# Altium schematic sheet Logic.SchDoc
size A
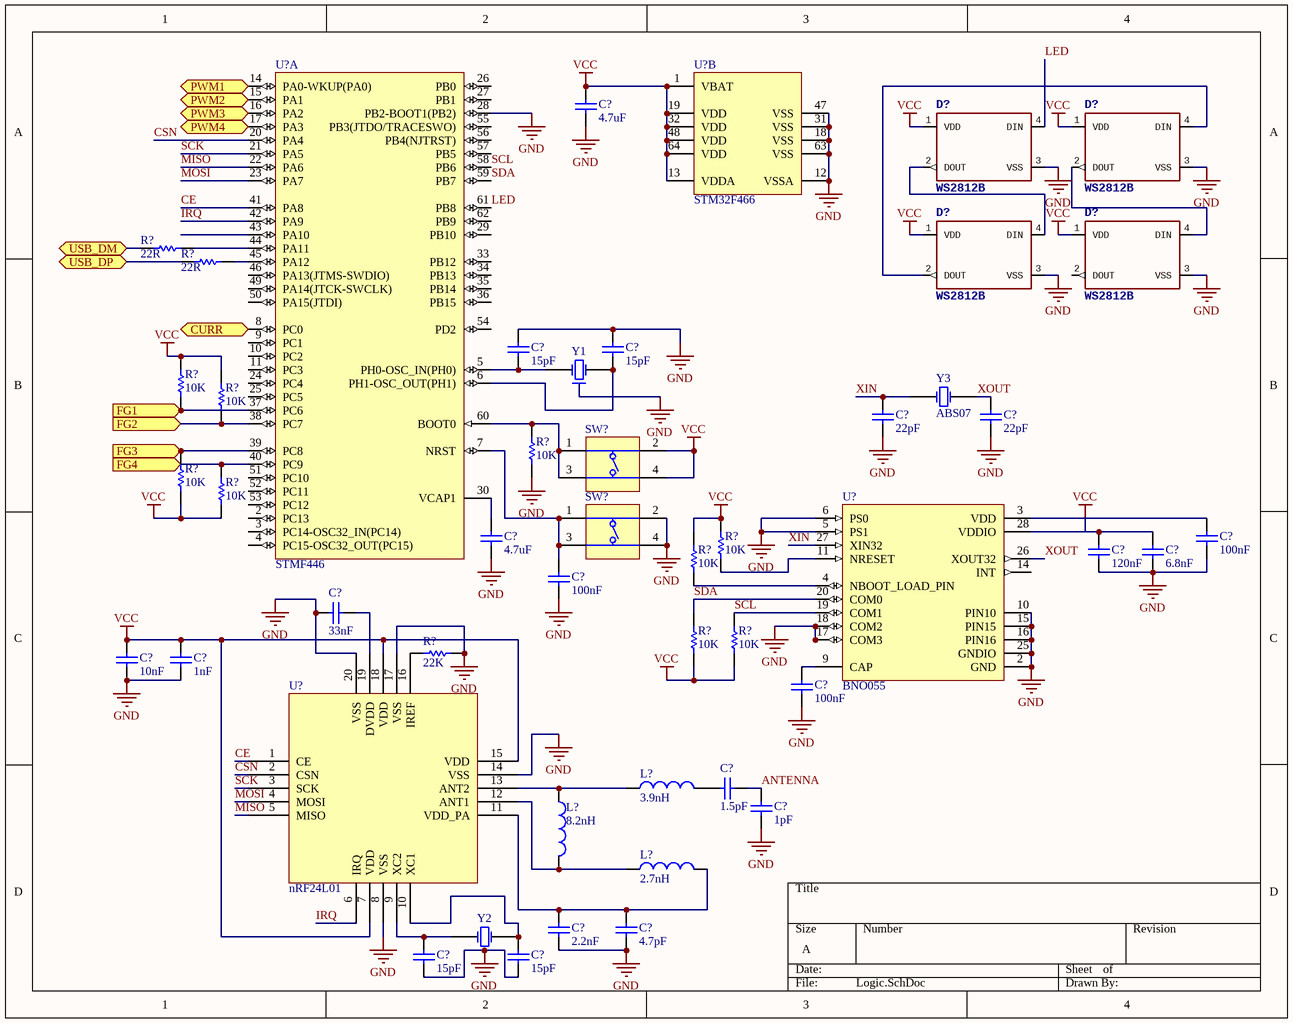
[diagram p0: Logic.SchDoc]

## Parts
(Parts that share a designator on the sheet are numbered #1, #2 ... from top to bottom, then left to right.)
C?#1  4.7uF  [CAPC0402(1005)60_L]
C?#2  15pF  [CAPC0402(1005)60_M]
C?#3  15pF  [CAPC0402(1005)60_M]
C?#4  22pF  [CAPC0402(1005)60_L]
C?#5  22pF  [CAPC0402(1005)60_L]
C?#6  4.7uF  [CAPC0402(1005)60_L]
C?#7  100nF  [CAPC0402(1005)60_M]
C?#8  120nF  [CAPC0402(1005)60_M]
C?#9  6.8nF  [CAPC0402(1005)60_L]
C?#10  100nF  [CAPC0402(1005)60_M]
C?#11  33nF  [CAPC0402(1005)60_M]
C?#12  10nF  [CAPC0402(1005)60_M]
C?#13  1nF  [CAPC0402(1005)60_M]
C?#14  100nF  [CAPC0402(1005)60_M]
C?#15  1.5pF  [CAPC0402(1005)60_L]
C?#16  1pF  [CAPC0402(1005)60_M]
C?#17  2.2nF  [CAPC0402(1005)60_N]
C?#18  4.7pF  [CAPC0402(1005)60_M]
C?#19  15pF  [CAPC0402(1005)60_N]
C?#20  15pF  [CAPC0402(1005)60_N]
D?#1  WS2812B  [WS2812B]
D?#2  WS2812B  [WS2812B]
D?#3  WS2812B  [WS2812B]
D?#4  WS2812B  [WS2812B]
L?#1  3.9nH  [INDC0402(1005)_N]
L?#2  8.2nH  [INDC0402(1005)_N]
L?#3  2.7nH  [INDC0402(1005)_N]
R?#1  22R  [RESC0402(1005)_M]
R?#2  22R  [RESC0402(1005)_M]
R?#3  10K  [RESC0402(1005)_N]
R?#4  10K  [RESC0402(1005)_N]
R?#5  10K  [RESC0402(1005)_N]
R?#6  10K  [RESC0402(1005)_N]
R?#7  10K  [RESC0402(1005)_N]
R?#8  10K  [RESC0402(1005)_N]
R?#9  10K  [RESC0402(1005)_N]
R?#10  10K  [RESC0402(1005)_N]
R?#11  10K  [RESC0402(1005)_N]
R?#12  22K  [RESC0402(1005)_L]
SW?#1  (no value)  [DIPT-DTSM-6_V]
SW?#2  (no value)  [DIPT-DTSM-6_V]
U?#1  STMF446  [STM-LQFP64_N]  (part A of 2)
U?#2  STM32F466  [STM-LQFP64_N]  (part B of 2)
U?#3  BNO055  [LGA28R50P4X10_380X520X100]
U?#4  (no value)  [QFN20]
Y1  (no value)  [ABRA-ABM3B-4_V]
Y2  (no value)  [ABRA-ABM3B-4_V]
Y3  ABS07  [ABS07]

## Ports
CURR (in), FG1 (in), FG2 (in), FG3 (in), FG4 (in), PWM1 (in), PWM2 (in), PWM3 (in), PWM4 (in), USB_DM (bidir), USB_DP (bidir)

## Nets
GND: C?#1.1 C?#2.2 C?#3.2 C?#4.1 C?#5.1 C?#6.1 C?#7.1 C?#8.1 C?#9.1 C?#10.1 C?#11.1 C?#12.1 C?#13.1 C?#14.1 C?#16.1 C?#17.1 C?#18.1 C?#19.1 C?#20.1 D?#1.3(VSS) D?#2.3(VSS) D?#3.3(VSS) D?#4.3(VSS) R?#5.1 R?#12.1 SW?#2.2(T2) SW?#2.4(T3) U?#1.28(PB2-BOOT1(PB2)) U?#2.12(VSSA) U?#2.18(VSS) U?#2.31(VSS) U?#2.47(VSS) U?#2.63(VSS) U?#3.2(GND) U?#3.5(PS1) U?#3.6(PS0) U?#3.10(PIN10) U?#3.15(PIN15) U?#3.16(PIN16) U?#3.17(COM3) U?#3.18(COM2) U?#3.25(GNDIO) U?#4.8(VSS) U?#4.14(VSS) U?#4.17(VSS) U?#4.20(VSS) Y1.2 Y2.2
VCC: C?#1.2 C?#7.2 C?#8.2 C?#9.2 C?#12.2 C?#13.2 D?#1.1(VDD) D?#2.1(VDD) D?#3.1(VDD) D?#4.1(VDD) R?#3.2 R?#4.2 R?#6.1 R?#7.1 R?#8.2 R?#9.2 R?#10.1 R?#11.1 SW?#1.2(T2) SW?#1.4(T3) U?#2.1(VBAT) U?#2.13(VDDA) U?#2.19(VDD) U?#2.32(VDD) U?#2.48(VDD) U?#2.64(VDD) U?#3.3(VDD) U?#3.28(VDDIO) U?#4.7(VDD) U?#4.15(VDD) U?#4.18(VDD)
ANTENNA: C?#15.2 C?#16.2
CE: U?#1.41(PA8) U?#4.1(CE)
CSN: U?#1.20(PA4) U?#4.2(CSN)
CURR: U?#1.8(PC0) ; port CURR
FG1: R?#3.1 U?#1.37(PC6) ; port FG1
FG2: R?#4.1 U?#1.38(PC7) ; port FG2
FG3: R?#6.2 U?#1.39(PC8) ; port FG3
FG4: R?#7.2 U?#1.40(PC9) ; port FG4
IRQ: U?#1.42(PA9) U?#4.6(IRQ)
LED: D?#1.4(DIN) U?#1.61(PB8)
MISO: U?#1.22(PA6) U?#4.5(MISO)
MOSI: U?#1.23(PA7) U?#4.4(MOSI)
PWM1: U?#1.14(PA0-WKUP(PA0)) ; port PWM1
PWM2: U?#1.15(PA1) ; port PWM2
PWM3: U?#1.16(PA2) ; port PWM3
PWM4: U?#1.17(PA3) ; port PWM4
SCK: U?#1.21(PA5) U?#4.3(SCK)
SCL: R?#11.2 U?#1.58(PB6) U?#3.19(COM1)
SDA: R?#10.2 U?#1.59(PB7) U?#3.20(COM0)
USB_DM: R?#1.1 ; port USB_DM
USB_DP: R?#2.1 ; port USB_DP
XIN: C?#4.2 U?#3.27(XIN32) Y3.1(X1)
XOUT: C?#5.2 U?#3.26(XOUT32) Y3.3(X2)
NetC?#2_1: C?#2.1 U?#1.5(PH0-OSC_IN(PH0)) Y1.1(X1)
NetC?#3_1: C?#3.1 U?#1.6(PH1-OSC_OUT(PH1)) Y1.3(X2)
NetC?#6_2: C?#6.2 U?#1.30(VCAP1)
NetC?#10_2: C?#10.2 SW?#2.1(T1) SW?#2.3(T3) U?#1.7(NRST)
NetC?#11_2: C?#11.2 U?#4.19(DVDD)
NetC?#14_2: C?#14.2 U?#3.9(CAP)
NetC?#15_1: C?#15.1 L?#1.2
NetC?#17_2: C?#17.2 C?#18.2 L?#3.2 U?#4.11(VDD_PA)
NetC?#19_2: C?#19.2 U?#4.9(XC2) Y2.1(X1)
NetC?#20_2: C?#20.2 U?#4.10(XC1) Y2.3(X2)
NetD?#1_2: D?#1.2(DOUT) D?#3.4(DIN)
NetD?#2_2: D?#2.2(DOUT) D?#4.4(DIN)
NetD?#2_4: D?#2.4(DIN) D?#3.2(DOUT)
NetL?#1_1: L?#1.1 L?#2.1 U?#4.13(ANT2)
NetL?#2_2: L?#2.2 L?#3.1 U?#4.12(ANT1)
NetR?#1_2: R?#1.2 U?#1.44(PA11)
NetR?#2_2: R?#2.2 U?#1.45(PA12)
NetR?#5_2: R?#5.2 SW?#1.1(T1) SW?#1.3(T3) U?#1.60(BOOT0)
NetR?#8_1: R?#8.1 U?#3.11(NRESET)
NetR?#9_1: R?#9.1 U?#3.4(NBOOT_LOAD_PIN)
NetR?#12_2: R?#12.2 U?#4.16(IREF)

Not connected (* = marked no-connect by the designer): D?#4 2(DOUT); U?#1 2(PC13) 3(PC14-OSC32_IN(PC14)) 4(PC15-OSC32_OUT(PC15)) 9(PC1) 10(PC2) 11(PC3) 24(PC4) 25(PC5) 26(PB0) 27(PB1) 29(PB10) 33(PB12) 34(PB13) 35(PB14) 36(PB15) 43(PA10) 46(PA13(JTMS-SWDIO)) 49(PA14(JTCK-SWCLK)) 50(PA15(JTDI)) 51(PC10) 52(PC11) 53(PC12) 54(PD2) 55(PB3(JTDO/TRACESWO)) 56(PB4(NJTRST)) 57(PB5) 62(PB9); U?#3 14(INT)

## Notes on the sheet
- (in symbol NRF24L01+) nRF24L01

## Library data of the parts
C?#1 C?#6 = CMP-1034-02136-1: CAP 4.7uF 6.3V ±10% 0402 (1005 Metric) Thickness 0.6mm SMD; Case-EIA: 0402; Tolerance: Â±10%; Case-Metric: 1005; Technology: SMT; Value: 4.7uF; Max Thickness: 0.6 mm; Rated Voltage: 6.3 V
C?#2 C?#3 = CMP-1034-00804-1: CAP 15pF 25V ±0.25pF 0402 (1005 Metric) Thickness 0.6mm SMD; Case-EIA: 0402; Tolerance: Â±0.25pF; Case-Metric: 1005; Rated Voltage: 25 V; Max Thickness: 0.6 mm; Value: 15pF; Technology: SMT
C?#4 C?#5 = CMP-1034-00911-1: CAP 22pF 25V ±10% 0402 (1005 Metric) Thickness 0.6mm SMD; Case-Metric: 1005; Case-EIA: 0402; Tolerance: Â±10%; Technology: SMT; Max Thickness: 0.6 mm; Rated Voltage: 25 V; Value: 22pF
C?#7 C?#8 C?#10 C?#14 = CMP-1034-02060-1: CAP 100nF 6.3V ±5% 0402 (1005 Metric) Thickness 0.6mm SMD; Case-EIA: 0402; Tolerance: Â±5%; Case-Metric: 1005; Rated Voltage: 6.3 V; Max Thickness: 0.6 mm; Value: 100nF; Technology: SMT
C?#9 = CMP-1034-01836-1: CAP 6.8nF 6.3V ±5% 0402 (1005 Metric) Thickness 0.6mm SMD; Case-EIA: 0402; Tolerance: Â±5%; Case-Metric: 1005; Max Thickness: 0.6 mm; Rated Voltage: 6.3 V; Value: 6.8nF; Technology: SMT
C?#11 = CMP-1034-01977-1: CAP 33nF 6.3V ±10% 0402 (1005 Metric) Thickness 0.6mm SMD; Tolerance: Â±10%; Case-Metric: 1005; Case-EIA: 0402; Technology: SMT; Rated Voltage: 6.3 V; Max Thickness: 0.6 mm; Value: 33nF
C?#12 = CMP-1034-01867-1: CAP 10nF 6.3V ±5% 0402 (1005 Metric) Thickness 0.6mm SMD; Case-EIA: 0402; Case-Metric: 1005; Tolerance: Â±5%; Technology: SMT; Rated Voltage: 6.3 V; Max Thickness: 0.6 mm; Value: 10nF
C?#13 = CMP-1034-01609-1: CAP 1nF 6.3V ±5% 0402 (1005 Metric) Thickness 0.6mm SMD; Case-EIA: 0402; Tolerance: Â±5%; Case-Metric: 1005; Rated Voltage: 6.3 V; Value: 1nF; Technology: SMT; Max Thickness: 0.6 mm
C?#15 = CMP-1034-00110-1: CAP 1.5pF 25V ±0.5pF 0402 (1005 Metric) Thickness 0.6mm SMD; Case-EIA: 0402; Case-Metric: 1005; Tolerance: Â±0.5pF; Max Thickness: 0.6 mm; Technology: SMT; Value: 1.5pF; Rated Voltage: 25 V
C?#16 = CMP-1034-00055-1: CAP 1pF 25V ±0.5pF 0402 (1005 Metric) Thickness 0.6mm SMD; Case-Metric: 1005; Tolerance: Â±0.5pF; Case-EIA: 0402; Value: 1pF; Rated Voltage: 25 V; Technology: SMT; Max Thickness: 0.6 mm
C?#17 = CMP-1034-01722-1: CAP 2.2nF 6.3V ±5% 0402 (1005 Metric) Thickness 0.6mm SMD; Tolerance: Â±5%; Case-EIA: 0402; Case-Metric: 1005; Max Thickness: 0.6 mm; Technology: SMT; Rated Voltage: 6.3 V; Value: 2.2nF
C?#18 = CMP-1034-00362-1: CAP 4.7pF 25V ±0.1pF 0402 (1005 Metric) Thickness 0.6mm SMD; Case-EIA: 0402; Case-Metric: 1005; Tolerance: Â±0.1pF; Max Thickness: 0.6 mm; Value: 4.7pF; Technology: SMT; Rated Voltage: 25 V
C?#19 C?#20 = CMP-1034-00809-1: CAP 15pF 25V ±10% 0402 (1005 Metric) Thickness 0.6mm SMD; Tolerance: Â±10%; Case-Metric: 1005; Case-EIA: 0402; Rated Voltage: 25 V; Value: 15pF; Max Thickness: 0.6 mm; Technology: SMT
D?#1-D?#4 = WS2812B: PROD_ID: DIO-12503
L?#1-L?#3 = INDC0402: Inductor; Code_IEC: 1005; Published: 8-Jun-2000; LatestRevisionDate: 29-May-2009; LatestRevisionNote: IPC-7351 Footprint Added.; PackageReference: 0402-A; Publisher: Altium Limited; PackageDescription: Chip Inductor; Code_JEITA: 0402
R?#1 R?#2 = CMP-1011-00034-1: 22R 0.063W 5% 0402 (1005 Metric)  SMD; Value: 22.00 Ohm; Case-EIA: 0402; Case-Metric: 1005; Power: 0.063 W; Tolerance: 5 %; Technology: SMT
R?#3-R?#11 = CMP-1011-00098-1: 10K 0.063W 5% 0402 (1005 Metric)  SMD; Case-Metric: 1005; Value: 10000.00 Ohm; Case-EIA: 0402; Technology: SMT; Tolerance: 5 %; Power: 0.063 W
R?#12 = CMP-1011-00106-1: 22K 0.063W 5% 0402 (1005 Metric)  SMD; Case-Metric: 1005; Value: 22000.00 Ohm; Case-EIA: 0402; Tolerance: 5 %; Technology: SMT; Power: 0.063 W
SW?#1 SW?#2 = CMP-0306-00001-1: Switch, SPNO Push Button SMD; Manufacturer: Diptronics; PartNumber: DTSM-61NT/R; Packing Type: Tape&Reel; Mechanical Life: 200,000 cycles; ComponentLink2URL: http://www.dip.com.tw/Products_tact.htm; ComponentLink1URL: http://www.dip.com.tw/; ComponentLink3URL: http://www.dip.com.tw/PDF/pro_tact/DTSM_G_-6_2_-V.pdf; PackageDescription: Switch, Through-Hole, 4 Leads, Body 8.5x8.5mm, Row Spacing 9.0mm, Pitch 4.5mm; ComponentLink2Description: Datasheet; ComponentLink3Description: Package Specification; ComponentLink1Description: Manufacturer URL; PackageReference: DTSM-6; Mounting Technology: Through Hole
U?#1 U?#2 = MC-ARM-STM32F4X5-SQ64
U?#4 = NRF24L01+: Part Field 1: 0603
Y1 Y2 = ABRA-ABM3B-4
U?#3 = BNO055: Value: *